# Altium schematic sheet S7CAS-PLEIADES-CARTE-MERE_P20_ADC.SchDoc
size Tabloid; SheetNumber: 16; SheetTotal: 20; Sheet_Name: ADC; Size: 11x17
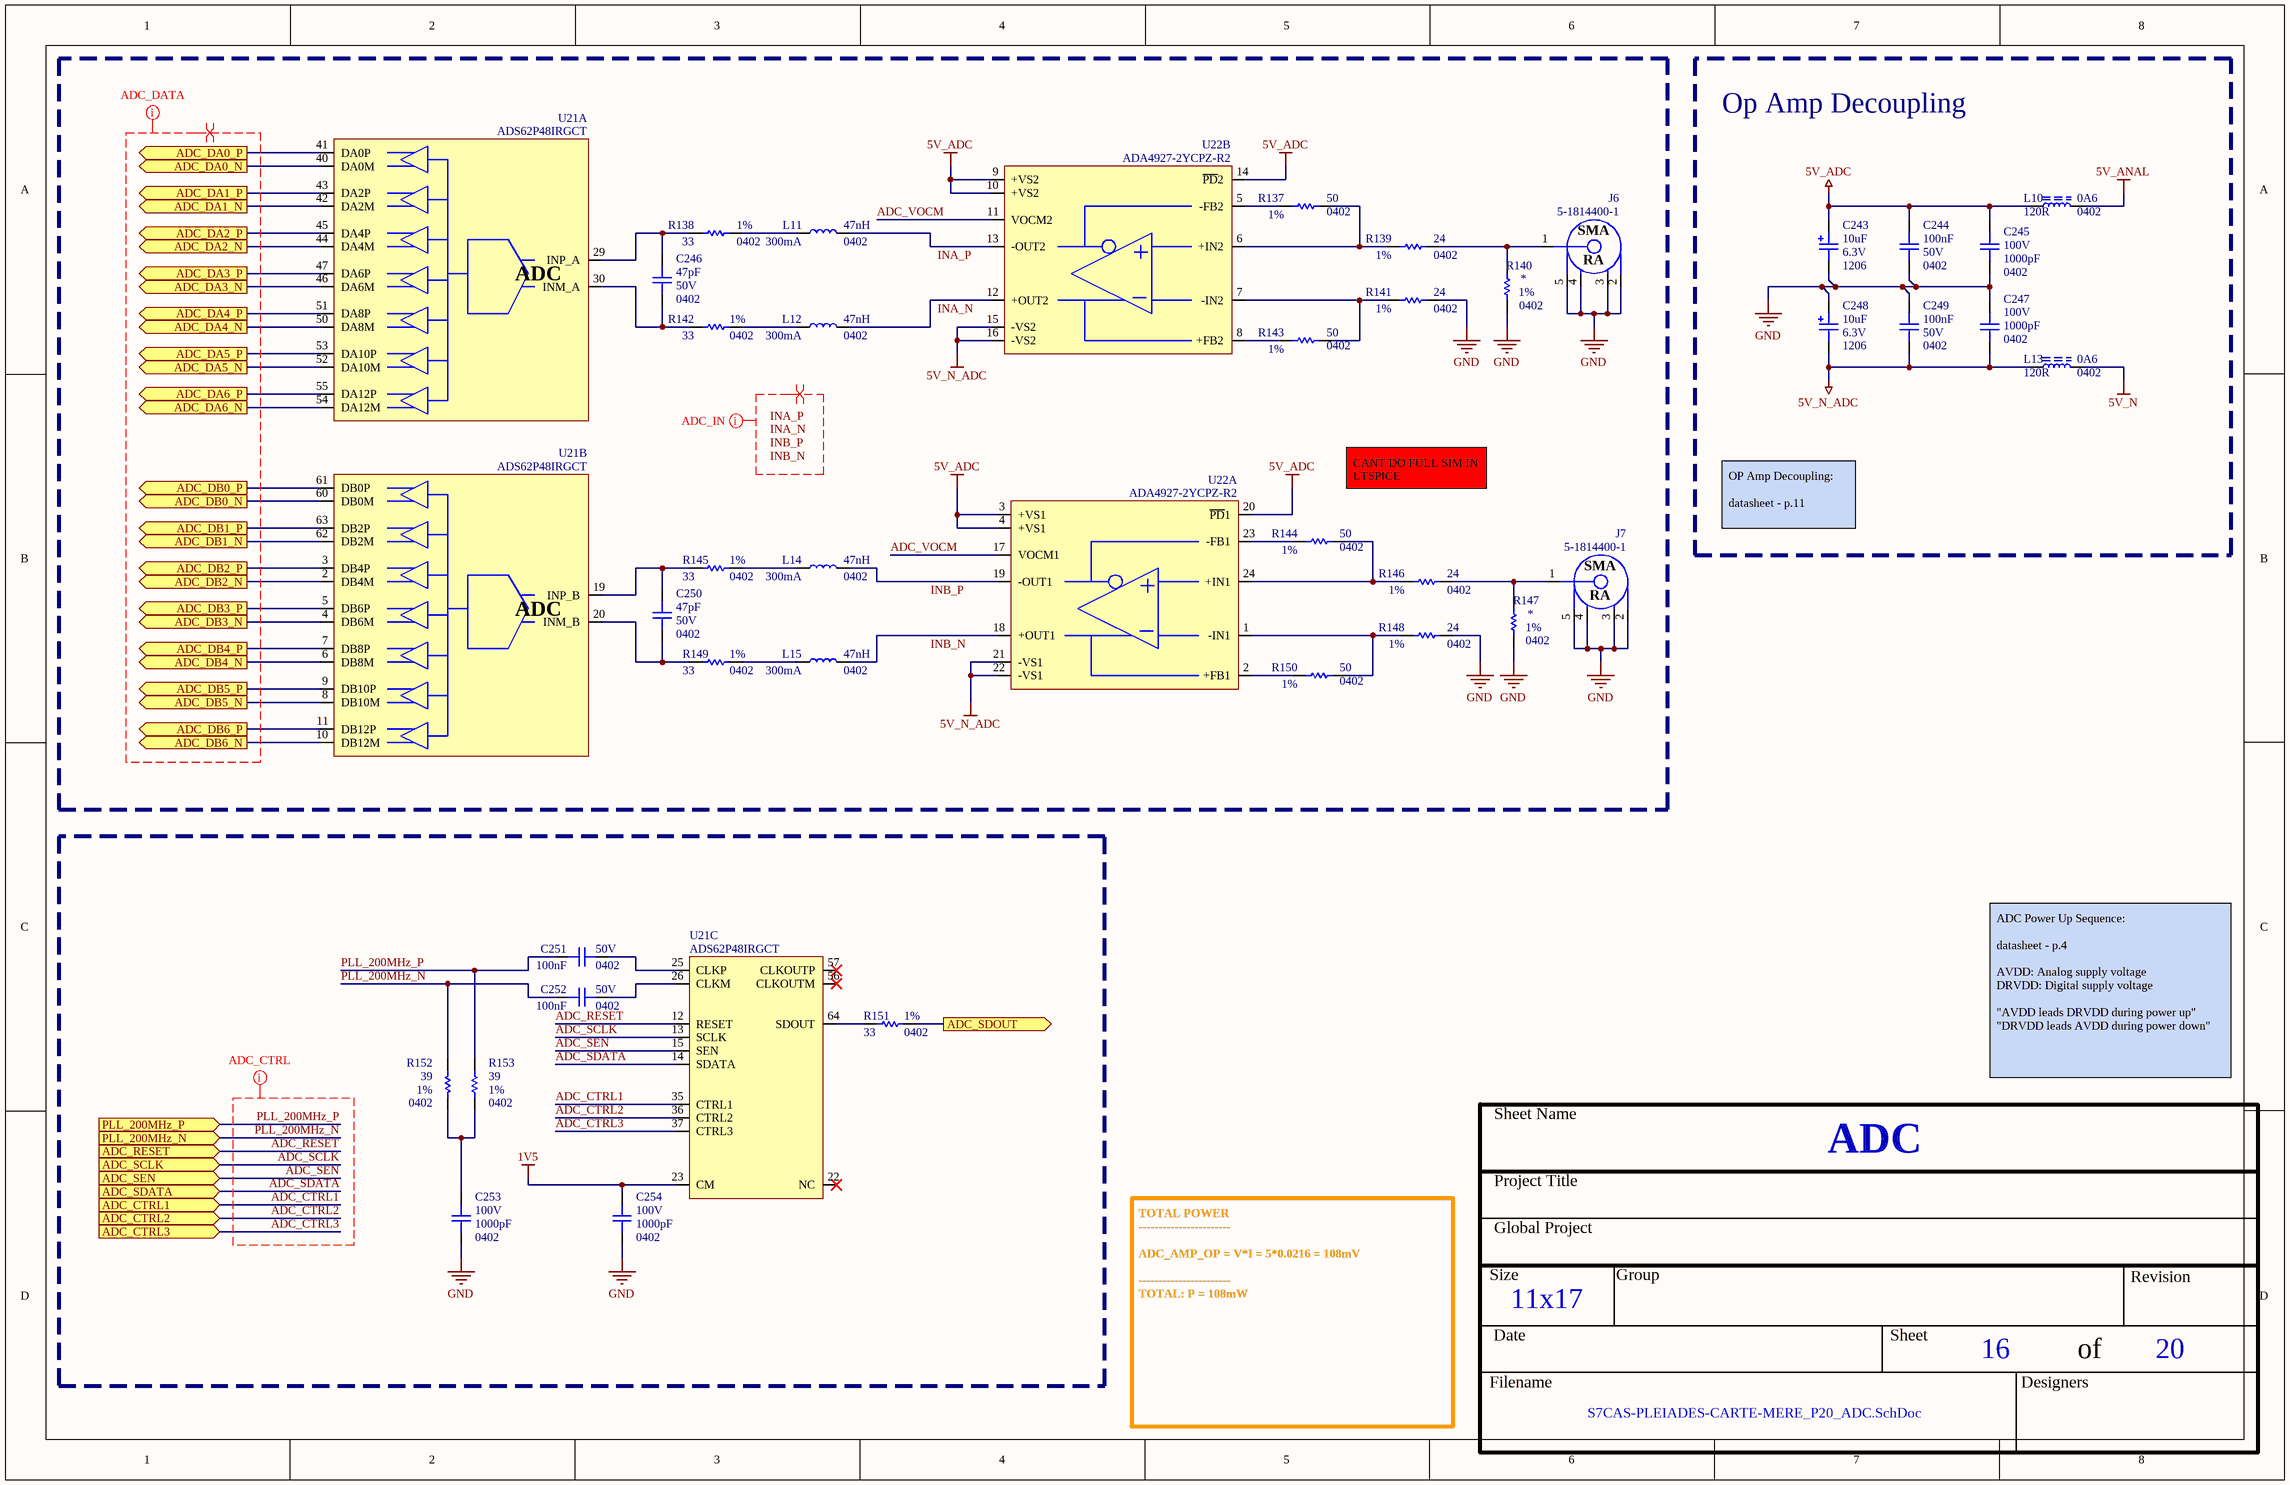
[diagram p0: S7CAS-PLEIADES-CARTE-MERE_P20_ADC.SchDoc]

## Parts
C243  value 10uF  Voltage: 6.3V  Package: 1206  [CAP_TAN_1206(A)]  (hidden comment: CAP - TANTALUM - CASE A)
C244  value 100nF  Voltage: 50V  Package: 0402  [CAP_0402]  (hidden comment: CAP - 0402)
C245  value 1000pF  Voltage: 100V  Package: 0402  [CAP_0402]  (hidden comment: CAP - 0402)
C246  value 47pF  Voltage: 50V  Package: 0402  [CAP_0402]  (hidden comment: CAP - 0402)
C247  value 1000pF  Voltage: 100V  Package: 0402  [CAP_0402]  (hidden comment: CAP - 0402)
C248  value 10uF  Voltage: 6.3V  Package: 1206  [CAP_TAN_1206(A)]  (hidden comment: CAP - TANTALUM - CASE A)
C249  value 100nF  Voltage: 50V  Package: 0402  [CAP_0402]  (hidden comment: CAP - 0402)
C250  value 47pF  Voltage: 50V  Package: 0402  [CAP_0402]  (hidden comment: CAP - 0402)
C251  value 100nF  Voltage: 50V  Package: 0402  [CAP_0402]  (hidden comment: CAP - 0402)
C252  value 100nF  Voltage: 50V  Package: 0402  [CAP_0402]  (hidden comment: CAP - 0402)
C253  value 1000pF  Voltage: 100V  Package: 0402  [CAP_0402]  (hidden comment: CAP - 0402)
C254  value 1000pF  Voltage: 100V  Package: 0402  [CAP_0402]  (hidden comment: CAP - 0402)
J6  5-1814400-1  [CONN_SMA_5-1814400-1]
J7  5-1814400-1  [CONN_SMA_5-1814400-1]
L10  value 120R  Current: 0A6  Package: 0402  [FER_0402]  (hidden comment: FER - 0402)
L11  value 47nH  Current: 300mA  Package: 0402  [IND_0402]  (hidden comment: Part Number)
L12  value 47nH  Current: 300mA  Package: 0402  [IND_0402]  (hidden comment: Part Number)
L13  value 120R  Current: 0A6  Package: 0402  [FER_0402]  (hidden comment: FER - 0402)
L14  value 47nH  Current: 300mA  Package: 0402  [IND_0402]  (hidden comment: Part Number)
L15  value 47nH  Current: 300mA  Package: 0402  [IND_0402]  (hidden comment: Part Number)
R137  value 50  Package: 0402  Precision: 1%  [RES_0402]  (hidden comment: RES - 0402)
R138  value 33  Package: 0402  Precision: 1%  [RES_0402]  (hidden comment: RES - 0402)
R139  value 24  Package: 0402  Precision: 1%  [RES_0402]  (hidden comment: RES - 0402)
R140  Package: 0402  Precision: 1%  [RES_0402]  (hidden comment: RES - 0402)
R141  value 24  Package: 0402  Precision: 1%  [RES_0402]  (hidden comment: RES - 0402)
R142  value 33  Package: 0402  Precision: 1%  [RES_0402]  (hidden comment: RES - 0402)
R143  value 50  Package: 0402  Precision: 1%  [RES_0402]  (hidden comment: RES - 0402)
R144  value 50  Package: 0402  Precision: 1%  [RES_0402]  (hidden comment: RES - 0402)
R145  value 33  Package: 0402  Precision: 1%  [RES_0402]  (hidden comment: RES - 0402)
R146  value 24  Package: 0402  Precision: 1%  [RES_0402]  (hidden comment: RES - 0402)
R147  Package: 0402  Precision: 1%  [RES_0402]  (hidden comment: RES - 0402)
R148  value 24  Package: 0402  Precision: 1%  [RES_0402]  (hidden comment: RES - 0402)
R149  value 33  Package: 0402  Precision: 1%  [RES_0402]  (hidden comment: RES - 0402)
R150  value 50  Package: 0402  Precision: 1%  [RES_0402]  (hidden comment: RES - 0402)
R151  value 33  Package: 0402  Precision: 1%  [RES_0402]  (hidden comment: RES - 0402)
R152  value 39  Package: 0402  Precision: 1%  [RES_0402]  (hidden comment: RES - 0402)
R153  value 39  Package: 0402  Precision: 1%  [RES_0402]  (hidden comment: RES - 0402)
U21  ADS62P48IRGCT  [ADC_ADS62P48IRGCT]  (parts A,B,C of 4)
U22  ADA4927-2YCPZ-R2  [OPAMP_ADA4927-2YCPZ-R2]  (parts A,B of 2)

## Blocks framed on the sheet
Op Amp Decoupling: C243-C245 C247-C249 L10 L13

## Ports
ADC_CTRL1 (in), ADC_CTRL2 (in), ADC_CTRL3 (in), ADC_DA0_N (out), ADC_DA0_P (out), ADC_DA1_N (out), ADC_DA1_P (out), ADC_DA2_N (out), ADC_DA2_P (out), ADC_DA3_N (out), ADC_DA3_P (out), ADC_DA4_N (out), ADC_DA4_P (out), ADC_DA5_N (out), ADC_DA5_P (out), ADC_DA6_N (out), ADC_DA6_P (out), ADC_DB0_N (out), ADC_DB0_P (out), ADC_DB1_N (out), ADC_DB1_P (out), ADC_DB2_N (out), ADC_DB2_P (out), ADC_DB3_N (out), ADC_DB3_P (out), ADC_DB4_N (out), ADC_DB4_P (out), ADC_DB5_N (out), ADC_DB5_P (out), ADC_DB6_N (out), ADC_DB6_P (out), ADC_RESET (in), ADC_SCLK (in), ADC_SDATA (in), ADC_SDOUT (out), ADC_SEN (in), PLL_200MHz_N (in), PLL_200MHz_P (in)

## Nets
1V5: C254.1 U21.23(CM)
5V_ADC: C243.2 C244.2 C245.1 L10.2 U22.3(+VS1) U22.4(+VS1) U22.9(+VS2) U22.10(+VS2) U22.14(~{PD}2) U22.20(~{PD}1)
5V_ANAL: L10.1
5V_N: L13.1
5V_N_ADC: C247.2 C248.1 C249.1 L13.2 U22.15(-VS2) U22.16(-VS2) U22.21(-VS1) U22.22(-VS1)
GND: C243.1 C244.1 C245.2 C247.1 C248.2 C249.2 C253.2 C254.2 J6.2 J6.3 J6.4 J6.5 J7.2 J7.3 J7.4 J7.5 R140.1 R141.1 R147.1 R148.1
ADC_CTRL1: U21.35(CTRL1) ; port ADC_CTRL1
ADC_CTRL2: U21.36(CTRL2) ; port ADC_CTRL2
ADC_CTRL3: U21.37(CTRL3) ; port ADC_CTRL3
ADC_DA0_N: U21.40(DA0M) ; port ADC_DA0_N
ADC_DA0_P: U21.41(DA0P) ; port ADC_DA0_P
ADC_DA1_N: U21.42(DA2M) ; port ADC_DA1_N
ADC_DA1_P: U21.43(DA2P) ; port ADC_DA1_P
ADC_DA2_N: U21.44(DA4M) ; port ADC_DA2_N
ADC_DA2_P: U21.45(DA4P) ; port ADC_DA2_P
ADC_DA3_N: U21.46(DA6M) ; port ADC_DA3_N
ADC_DA3_P: U21.47(DA6P) ; port ADC_DA3_P
ADC_DA4_N: U21.50(DA8M) ; port ADC_DA4_N
ADC_DA4_P: U21.51(DA8P) ; port ADC_DA4_P
ADC_DA5_N: U21.52(DA10M) ; port ADC_DA5_N
ADC_DA5_P: U21.53(DA10P) ; port ADC_DA5_P
ADC_DA6_N: U21.54(DA12M) ; port ADC_DA6_N
ADC_DA6_P: U21.55(DA12P) ; port ADC_DA6_P
ADC_DB0_N: U21.60(DB0M) ; port ADC_DB0_N
ADC_DB0_P: U21.61(DB0P) ; port ADC_DB0_P
ADC_DB1_N: U21.62(DB2M) ; port ADC_DB1_N
ADC_DB1_P: U21.63(DB2P) ; port ADC_DB1_P
ADC_DB2_N: U21.2(DB4M) ; port ADC_DB2_N
ADC_DB2_P: U21.3(DB4P) ; port ADC_DB2_P
ADC_DB3_N: U21.4(DB6M) ; port ADC_DB3_N
ADC_DB3_P: U21.5(DB6P) ; port ADC_DB3_P
ADC_DB4_N: U21.6(DB8M) ; port ADC_DB4_N
ADC_DB4_P: U21.7(DB8P) ; port ADC_DB4_P
ADC_DB5_N: U21.8(DB10M) ; port ADC_DB5_N
ADC_DB5_P: U21.9(DB10P) ; port ADC_DB5_P
ADC_DB6_N: U21.10(DB12M) ; port ADC_DB6_N
ADC_DB6_P: U21.11(DB12P) ; port ADC_DB6_P
ADC_RESET: U21.12(RESET) ; port ADC_RESET
ADC_SCLK: U21.13(SCLK) ; port ADC_SCLK
ADC_SDATA: U21.14(SDATA) ; port ADC_SDATA
ADC_SDOUT: R151.1 ; port ADC_SDOUT
ADC_SEN: U21.15(SEN) ; port ADC_SEN
ADC_VOCM: U22.11(VOCM2) U22.17(VOCM1)
INA_N: L12.2 U22.12(+OUT2)
INA_P: L11.2 U22.13(-OUT2)
INB_N: L15.2 U22.18(+OUT1)
INB_P: L14.2 U22.19(-OUT1)
PLL_200MHz_N: C252.2 R152.2 ; port PLL_200MHz_N
PLL_200MHz_P: C251.2 R153.2 ; port PLL_200MHz_P
NetC246_1: C246.1 R142.2 U21.30(INM_A)
NetC246_2: C246.2 R138.2 U21.29(INP_A)
NetC250_1: C250.1 R149.2 U21.20(INM_B)
NetC250_2: C250.2 R145.2 U21.19(INP_B)
NetC251_1: C251.1 U21.25(CLKP)
NetC252_1: C252.1 U21.26(CLKM)
NetC253_1: C253.1 R152.1 R153.1
NetJ6_1: J6.1 R139.1 R140.2
NetJ7_1: J7.1 R146.1 R147.2
NetL11_1: L11.1 R138.1
NetL12_1: L12.1 R142.1
NetL14_1: L14.1 R145.1
NetL15_1: L15.1 R149.1
NetR137_1: R137.1 R139.2 U22.6(+IN2)
NetR137_2: R137.2 U22.5(-FB2)
NetR141_2: R141.2 R143.1 U22.7(-IN2)
NetR143_2: R143.2 U22.8(+FB2)
NetR144_1: R144.1 R146.2 U22.24(+IN1)
NetR144_2: R144.2 U22.23(-FB1)
NetR148_2: R148.2 R150.1 U22.1(-IN1)
NetR150_2: R150.2 U22.2(+FB1)
NetR151_2: R151.2 U21.64(SDOUT)

Not connected (* = marked no-connect by the designer): U21 22(NC)* 56(CLKOUTM)* 57(CLKOUTP)*

## Layout directives
net class TRACKS_50: (no net found under the mark), ADC_CTRL1, ADC_CTRL2, ADC_CTRL3, ADC_RESET, ADC_SCLK, ADC_SDATA, ADC_SEN, INA_N, INA_P, INB_N, INB_P, PLL_200MHz_N, PLL_200MHz_P
differential pair: (no net found under the mark), INA_N, INA_P, INB_N, INB_P

## Notes on the sheet
- CANT DO FULL SIM IN LTSPICE
- OP Amp Decoupling:
  datasheet - p.11
- ADC Power Up Sequence:
  datasheet - p.4
  AVDD: Analog supply voltage
  DRVDD: Digital supply voltage
  "AVDD leads DRVDD during power up"
  "DRVDD leads AVDD during power down"
- TOTAL POWER
  -----------------------
  ADC_AMP_OP = V*I = 5*0.0216 = 108mV
  -----------------------
  TOTAL: P = 108mW
- Labels drawn without touching a wire or pin: INA_N, INA_P, INB_N, INB_P
- Sheet Name
- Project Title
- Global Project
- Size
- Group
- Revision
- Date
- Sheet
- of
- Filename
- Designers
- (in symbol ADC_ADS62P48IRGCT, part A) ADC
- (in symbol ADC_ADS62P48IRGCT, part B) ADC
- (in symbol CONN_SMA_5-1814400-1) SMA; RA

## Library data of the parts
C243 C248 = CAP_TANT_1206(A): CAP - TANTALUM - 1206; Mfg Part Number: TBD; Precision: 10%; Current: *; HelpURL: TBD; CreatedBy: Jonathan Bouchard; Power: *
C244 C249 C251 C252 = CAP - 0402: Mfg Part Number: GRM155R61H104KE14; Precision: 10%; Current: *; CreatedBy: Jonathan Bouchard; Power: *
C245 C247 C253 C254 = CAP - 0402: Mfg Part Number: GRM155R72A102KA01; Precision: 10%; Current: *; CreatedBy: Jonathan Bouchard; Power: *
C246 C250 = CAP - 0402: Mfg Part Number: GRM1555C1H470GA01; Precision: 10%; Current: *; CreatedBy: Jonathan Bouchard; Power: *
J6 J7 = CONN_SMA_5-1814400-1: CONN -  SMA JACK R/A 50 OHM - TH; Mfg: TE Connectivity AMP Connectors; Voltage: *; Current: *; Power: *; Mfg Part Number: 5-1814400-1; HelpURL: http://www.te.com/commerce/DocumentDelivery/DDEController?Action=srchrtrv&DocNm=1814400&DocType=Customer+Drawing&DocLang=English; CreatedBy: Jonathan Bouchard; Temperature: -55°C ~ 85°C; Value: *; Precision: *; Package: TH-5; Supplier 1: Digikey; Supplier Part Number 1: A97593-ND
L10 L13 = FER - 0402: Mfg Part Number: BLM15BX121SN1; Voltage: *; CreatedBy: Jonathan Bouchard; Power: *; Precision: *
L11 L12 L14 L15 = IND - 0402: Mfg Part Number: TBD; Voltage: *
R137 R143 R144 R150 = RES - 0402: Mfg Part Number: FC0402E50R0FTBST0; Voltage: 50V; Power: 1/16W; Current: *; CreatedBy: Jonathan Bouchard
R138 R142 R145 R149 R151 = RES - 0402: Mfg Part Number: CRCW040233R0FKEDC; Voltage: 50V; Power: 1/16W; Current: *; CreatedBy: Jonathan Bouchard
R139 R141 R146 R148 = RES - 0402: Mfg Part Number: MCS04020C2409FE000; Voltage: 50V; Power: 1/16W; Current: *; CreatedBy: Jonathan Bouchard
R140 R147 = RES - 0402: Voltage: 50V; Power: 1/16W; Current: *; CreatedBy: Jonathan Bouchard; Value: *
R152 R153 = RES - 0402: Mfg Part Number: RL0510S-390-F; Voltage: 50; Power: 1/16W; Current: *; CreatedBy: Jonathan Bouchard
U21 = ADC_ADS62P48IRGCT: ADC - 14 BIT 210MSPS SUAL - VQFN-64; Voltage: 3.15 V ~ 3.6 V / 1.7 V ~ 1.9 V; Mfg: Texas Instruments; Precision: 14 Bit; Current: *; Power: *; Mfg Part Number: ADS62P48IRGCT; HelpURL: http://www.ti.com/lit/ds/symlink/ads62p48.pdf; CreatedBy: Jonathan Bouchard; Temperature: -40°C ~ 85°C; Value: *; Package: VQFN-64; Supplier 1: Digikey; Supplier Part Number 1: 296-24611-1-ND
U22 = OPAMP_ADA4927-2YCPZ-R2: OPAMP - CFA 2.3GHZ - QFN-24; Voltage: 4.5 V ~ 11 V, ±2.25 V ~ 5.5 V; Current: 65mA; Mfg: Analog Devices; Power: *; Mfg Part Number: ADA4927-2YCPZ-R2; HelpURL: http://www.analog.com/media/en/technical-documentation/data-sheets/ADA4927-1_4927-2.pdf; CreatedBy: Jonathan Bouchard; Temperature: -40°C ~ 105°C; Value: *; Precision: *; Package: QFN-24; Supplier 1: Digikey; Supplier Part Number 1: ADA4927-2YCPZ-R2CT-ND